# EAGLE design lightdimmer_rc (EAGLE 7.6.0)
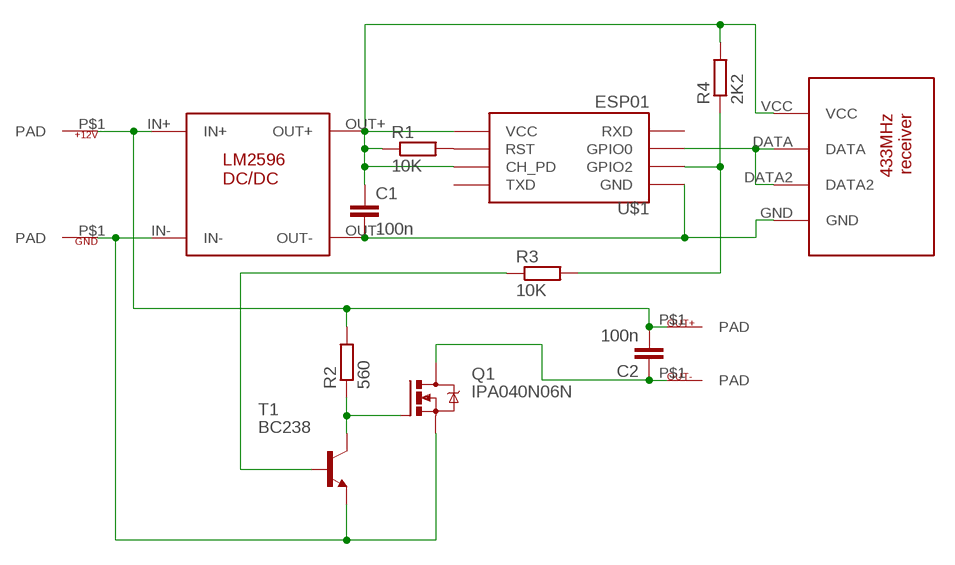
[diagram p0: schematic, sheet 1]

## Parts
+12V  PAD  [PAD]
C1  100n  C-EU050-025X075  [C050-025X075]
C2  100n  C-EU050-025X075  [C050-025X075]
GND  PAD  [PAD]
OUT+  PAD  [PAD]
OUT-  PAD  [PAD]
Q1  IPA040N06N  IRF520  [TO220BV]
R1  10K  R-EU_0204/7  [0204/7]
R2  560  R-EU_0204/7  [0204/7]
R3  10K  R-EU_0204/7  [0204/7]
R4  2K2  R-EU_0204/7  [0204/7]
T1  BC238  BC238-NPN-TO92-CBE  [TO92-CBE]
U$1  ESP01  [ESP01]
U$2  RECV433MHZ  [RECV433MHZ]
U$3  LM2596DCDC  [LM2596DCDC]

## Nets
N$3: C1.1 R1.1 R4.2 U$1.CH_PD U$1.VCC U$2.VCC U$3.OUT+
N$4: C1.2 U$1.GND U$2.GND U$3.OUT-
N$5: U$1.GPIO0 U$2.DATA U$2.DATA2
N$6: C2.1 OUT-.P$1(PAD) Q1.D
N$7: GND.P$1(PAD) Q1.S T1.E U$3.IN-
N$8: Q1.G R2.1 T1.C
N$9: +12V.P$1(PAD) C2.2 OUT+.P$1(PAD) R2.2 U$3.IN+
N$10: R3.2 R4.1 U$1.GPIO2
N$11: R1.2 U$1.RST
N$12: R3.1 T1.B
Unconnected: U$1.RX(RXD) U$1.TX(TXD)

## Library data of the parts
+12V GND OUT+ OUT- = LEG-1A-5:PAD
C1 C2 = rcl:C-EU: CAPACITOR, European symbol
Q1 = transistor-power:IRF520: HEXFET Power MOSFET
R1-R4 = rcl:R-EU_: RESISTOR, European symbol
T1 = transistor:*-NPN-: NPN Transistror BF959 corrected 2008.03.06
U$1 = esp8266modules:ESP01: ESP8266 Wifi module 01
U$2 = 433mhz:RECV433MHZ
U$3 = LM2596_DCDC:LM2596DCDC

## Board
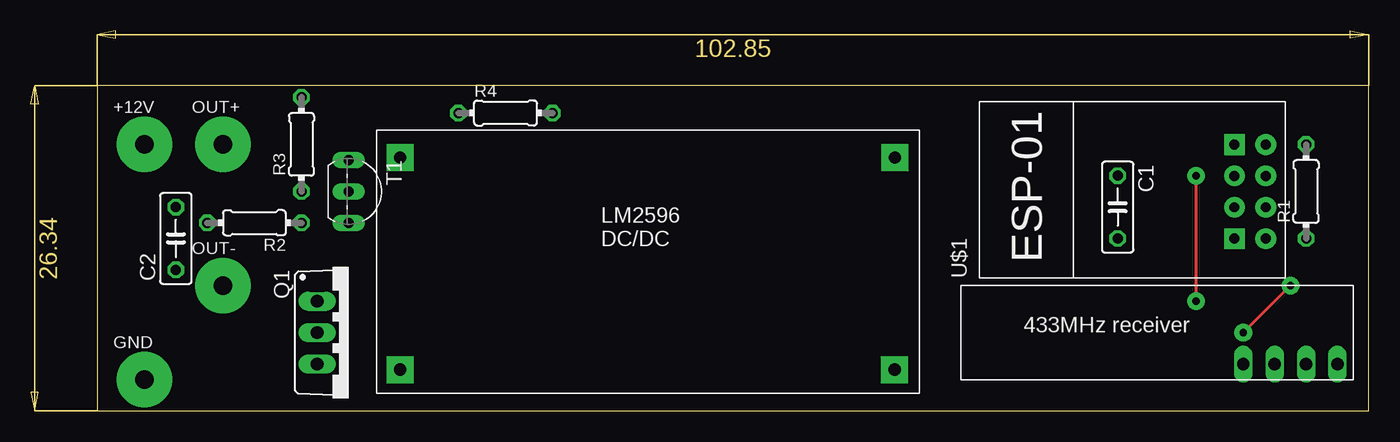
[diagram p1: board, top side]
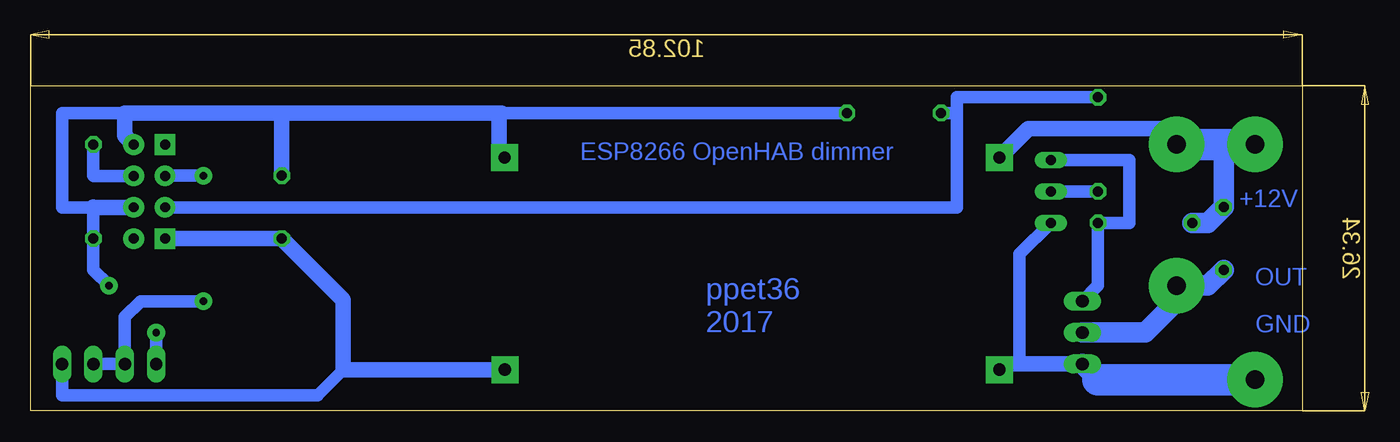
[diagram p2: board, bottom side, seen from below]

Size 102.85 x 26.34 mm. Coordinates in mm from the lower left corner, seen from the top.
Outline: 0,0 102.85,0 102.85,26.34 0,26.34 0,0
Copper layers (1*16): Top 0.035mm / dielectric 1.5mm / Bottom 0.035mm
Design rules "default": minimum track width 10mil, minimum drill 24mil, track to track 8mil, track to pad 8mil, pad to pad 8mil, via to via 8mil, smd to smd 8mil, copper to edge 40mil, drill to drill 8mil, minimum pad ring 10mil, minimum via ring 8mil, stop-mask expansion 4mil, vias tented up to drill 0mil, thermal gap 10mil

### Footprints (pad centres in the part's own frame; a part is rotated, then mirrored left to right if it is on the bottom)
PAD = drill 1.5 pad 4.5: P$1 0,0
C050-025X075 = drill 0.813 octagon: 1 -2.54,0; 2 2.54,0
TO220BV = drill 1.016 long: D 0,-2.54; G -2.54,-2.54; S 2.54,-2.54
0204/7 = drill 0.813 octagon: 1 -3.81,0; 2 3.81,0
TO92-CBE = drill 0.813 long: B 0,0; C -2.54,0; E 2.54,0
ESP01 = drill 0.8 pad 1.676: CH_PD -1.285,-8.178; GPIO0 1.255,-5.638; GPIO2 -1.285,-5.638; RST 1.255,-8.178; TX -3.825,-8.178; VCC 3.795,-8.178 | drill 0.8 pad 1.676 square: GND -3.825,-5.638; RX 3.795,-5.638
RECV433MHZ = drill 1 long: DATA 5.08,-1.27; DATA2 2.54,-1.27; GND 7.62,-1.27; VCC 0,-1.27
LM2596DCDC = drill 1 pad 2.184 square: IN+ -21.23,7.82; IN- -21.23,-9.355; OUT+ 18.805,7.82; OUT- 18.785,-9.355

### Placement (x,y rotation side)
+12V  3.81,21.59 0 top
C1  82.55,16.51 270 top
C2  6.35,13.97 90 top
GND  3.81,2.54 0 top
OUT+  10.16,21.59 0 top
OUT-  10.16,10.16 0 top
Q1  20.32,6.35 270 top
R1  97.79,17.78 90 top
R2  12.7,15.24 180 top
R3  16.51,21.59 90 top
R4  33.02,24.13 0 top
T1  20.32,17.78 270 top
U$1  86.36,17.78 90 top
U$2  92.71,5.08 0 top
U$3  45.72,12.7 0 top

### Tracks (layer width: path | path; a pad name or v marks a point on that pad's centre or on a via)
N$3  (via drill 0.6 pad 1.42)
  Top 0.254: v92.71,6.35 v96.52,10.16
  Bottom 1.016: 97.79,16.51 R1.1 97.79,11.43 v96.52,10.16 | U$1.CH_PD 100.31,16.5 100.33,16.51 100.33,24.13 95.25,24.13 | U$2.VCC v92.71,6.35 | R4.2 64.77,24.13 64.97,23.93
  Bottom 1.27: U$3.OUT+ 64.97,20.52 64.97,23.93 | 68.58,24.13 69.85,24.13 | 69.85,24.13 82.55,24.13 | 82.55,24.13 95.25,24.13 95.25,22.29 U$1.VCC | C1.1 82.55,24.13 | U$1.CH_PD 97.78,16.5 97.79,16.51 | 69.85,24.13 64.77,24.13
N$4
  Bottom 1.016: U$2.GND 100.33,1.27 79.65,1.27 77.58,3.35
  Bottom 1.27: U$3.OUT- 77.58,3.35 77.58,9 C1.2 91.98,13.97 U$1.GND
N$5  (via drill 0.6 pad 1.42)
  Top 0.254: v88.9,8.89 v88.9,19.05
  Bottom 1.016: U$2.DATA U$2.DATA2 95.25,7.62 93.98,8.89 v88.9,8.89 | v88.9,19.05 91.98,19.05
  Bottom 1.27: 91.98,19.05 U$1.GPIO0
N$6
  Bottom 1.676: C2.1 7.62,10.16 OUT-.P$1 10.16,8.89 12.7,6.35 Q1.D
N$7
  Bottom 1.016: T1.E 22.86,12.7 22.86,3.81
  Bottom 1.27: U$3.IN- 24.02,3.81 22.86,3.81 Q1.S
  Bottom 1.676: 16.51,2.54 Q1.S
  Bottom 2.54: GND.P$1 16.51,2.54
N$8
  Bottom 1.016: Q1.G 16.51,10.16 R2.1 13.97,15.24 13.97,20.32 T1.C
N$9
  Bottom 1.27: U$3.IN+ 22.15,22.86 11.43,22.86 OUT+.P$1
  Bottom 1.676: 6.35,21.59 C2.2 7.62,15.24 R2.2
  Bottom 2.54: OUT+.P$1 6.35,21.59 +12V.P$1
N$10
  Bottom 1.016: U$1.GPIO2 27.93,16.5 27.93,24.13 | 27.93,24.13 27.93,25.39 27.91,25.4 R3.2 | R4.1 27.93,24.13
N$11
  Bottom 1.016: U$1.RST 97.78,19.04 97.79,19.05 R1.2
N$12
  Bottom 1.016: R3.1 T1.B

### Text on the board
Bottom: ESP8266 OpenHAB dimmer | +12V | OUT | GND | ppet36 / 2017